# EAGLE design transponder (EAGLE 9.2.2)
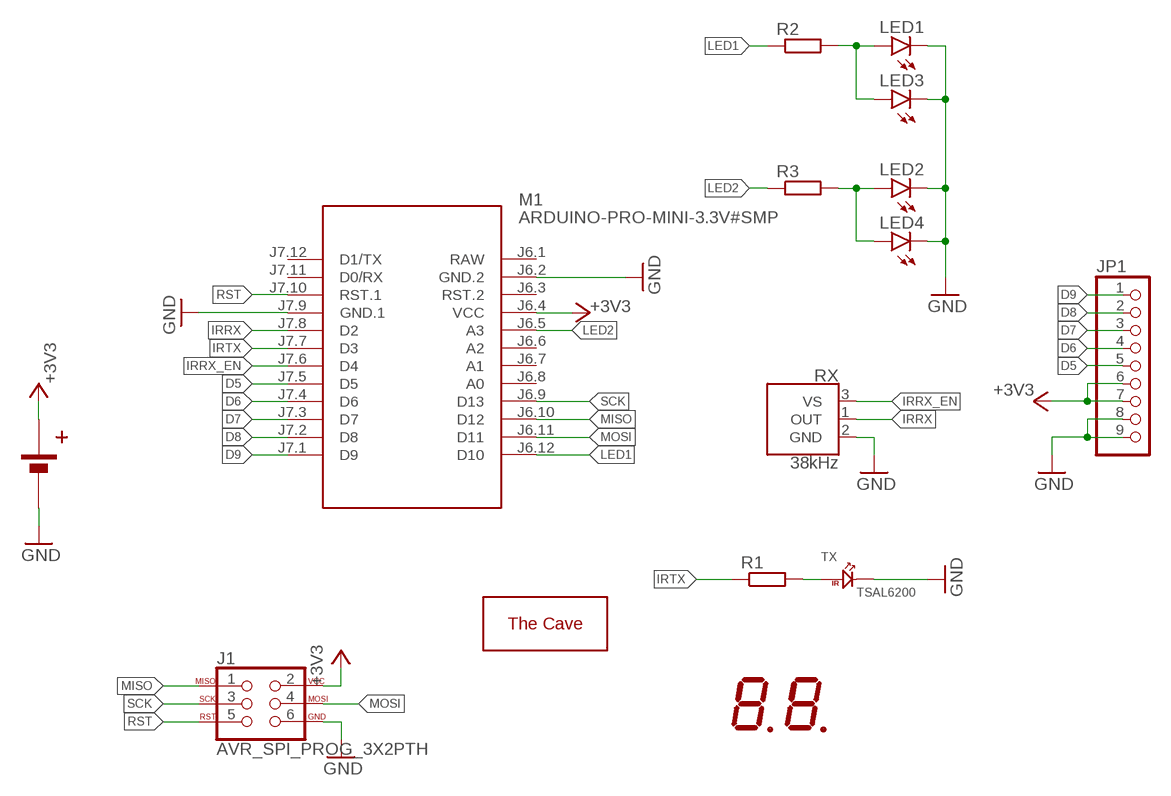
[diagram p0: schematic, sheet 1]

## Parts
BAT1  BH-321-2P  [2AA_BATTERY]
J1  AVR_SPI_PROG_3X2PTH  [2X3]
JP1  PINHD-1X9  [1X09]
LED1  LED5MM  [LED5MM]
LED2  LED5MM  [LED5MM]
LED3  LEDCHIPLED_1206  [CHIPLED_1206]
LED4  LEDCHIPLED_1206  [CHIPLED_1206]
LED5  LCD_DIGIT  [LCD_DIGIT]
LED6  LCD_DIGIT  [LCD_DIGIT]
M1  ARDUINO-PRO-MINI-3.3V#SMP  [ARDUINO-PRO-MINI#SMP]
R1  R-EU_R0805  [R0805]
R2  R-EU_R0805  [R0805]
R3  R-EU_R0805  [R0805]
RX  38kHz  TSOP38238  [TSOP382]
TX  TSAL6200  [TSAL6200]
U$1  THECAVE_LOGO_NEW_TOP_SMALL  [NEW_LOGO_SMALL_TOP]

## Nets
+3V3: BAT1.P$1(VCC) J1.2 JP1.6 JP1.7 M1.J6.4(VCC)
D5: JP1.5 M1.J7.5(D5)
D6: JP1.4 M1.J7.4(D6)
D7: JP1.3 M1.J7.3(D7)
D8: JP1.2 M1.J7.2(D8)
D9: JP1.1 M1.J7.1(D9)
GND: BAT1.P$2(GND) J1.6 JP1.8 JP1.9 LED1.K(C) LED2.K(C) LED3.C LED4.C M1.J6.2(GND.2) M1.J7.9(GND.1) RX.2(GND) TX.N
IRRX: M1.J7.8(D2) RX.1(OUT)
IRRX_EN: M1.J7.6(D4) RX.3(VS)
IRTX: M1.J7.7(D3) R1.1
LED1: M1.J6.12(D10) R2.1
LED2: M1.J6.5(A3) R3.1
MISO: J1.1 M1.J6.10(D12)
MOSI: J1.4 M1.J6.11(D11)
N$2: R1.2 TX.P
N$3: LED1.A LED3.A R2.2
N$5: LED2.A LED4.A R3.2
RST: J1.5 M1.J7.10(RST.1)
SCK: J1.3 M1.J6.9(D13)
Unconnected: M1.J6.3(RST.2) M1.J6.6(A2) M1.J6.7(A1) M1.J6.8(A0) M1.J7.11(D0/RX) M1.J7.12(D1/TX)

## Power pins joined to a net without a drawn wire
RAW: M1.J6.1(RAW)

## Library data of the parts
BAT1 = thecave:BH-321-2P: COMF BH-321-2P 2x AA battery holder https://www.tme.eu/cz/details/bh-321-2p/baterie-pouzdra-i-drzaky/comf/
J1 = SparkFun-Connectors:AVR_SPI_PROG_3X2: AVR ISP 6 Pin This is the reduced ISP connector for AVR programming. Common on Arduino. This footprint will take up less PCB space and can be used with a 10-pin to 6-pin adapter such as SKU: BOB-08508 **Special note about "TEST_POINT" package. The stop mask is on the top side, so if you want your programming test points to be on the bottom of your board, make sure to place this package on the bottom side of the board. This also ensure that the orientation to program from the bottom side will be correct. SparkFun Products: SparkFun ISP Pogo Adapter <https://www.sparkfun.com/products/11591> - NS Tiny AVR Programmer <https://www.sparkfun.com/products/11801> -PTH
JP1 = pinhead:PINHD-1X9: PIN HEADER
LED1-LED4 = led:LED: LED OSRAM: - CHIPLED LG R971, LG N971, LY N971, LG Q971, LY Q971, LO R971, LY R971 LH N974, LH R974 LS Q976, LO Q976, LY Q976 LO Q996 - Hyper CHIPLED LW Q18S LB Q993, LB Q99A, LB R99A - SideLED LS A670, LO A670, LY A670, LG A670, LP A670 LB A673, LV A673, LT A673, LW A673 LH A674 LY A675 LS A676, LA A676, LO A676, LY A676, LW A676 LS A679, LY A679, LG A679 - Hyper Micro SIDELED® LS Y876, LA Y876, LO Y876, LY Y876 LT Y87S - SmartLED LW L88C, LW L88S LB L89C, LB L89S, LG L890 LS L89K, LO L89K, LY L89K LS L896, LA L896, LO L896, LY L896 - TOPLED LS T670, LO T670, LY T670, LG T670, LP T670 LSG T670, LSP T670, LSY T670, LOP T670, LYG T670 LG T671, LOG T671, LSG T671 LB T673, LV T673, LT T673, LW T673 LH T674 LS T676, LA T676, LO T676, LY T676, LB T676, LH T676, LSB T676, LW T676 LB T67C, LV T67C, LT T67C, LS T67K, LO T67K, LY T67K, LW E67C LS E67B, LA E67B, LO E67B, LY E67B, LB E67C, LV E67C, LT E67C LW T67C LS T679, LY T679, LG T679 LS T770, LO T770, LY T770, LG T770, LP T770 LB T773, LV T773, LT T773, LW T773 LH T774 LS E675, LA E675, LY E675, LS T675 LS T776, LA T776, LO T776, LY T776, LB T776 LHGB T686 LT T68C, LB T68C - Hyper Mini TOPLED® LB M676 - Mini TOPLED Santana® LG M470 LS M47K, LO M47K, LY M47K Source: http://www.osram.convergy.de LUXEON: - LUMILED® LXK2-PW12-R00, LXK2-PW12-S00, LXK2-PW14-U00, LXK2-PW14-V00 LXK2-PM12-R00, LXK2-PM12-S00, LXK2-PM14-U00 LXK2-PE12-Q00, LXK2-PE12-R00, LXK2-PE12-S00, LXK2-PE14-T00, LXK2-PE14-U00 LXK2-PB12-K00, LXK2-PB12-L00, LXK2-PB12-M00, LXK2-PB14-N00, LXK2-PB14-P00, LXK2-PB14-Q00 LXK2-PR12-L00, LXK2-PR12-M00, LXK2-PR14-Q00, LXK2-PR14-R00 LXK2-PD12-Q00, LXK2-PD12-R00, LXK2-PD12-S00 LXK2-PH12-R00, LXK2-PH12-S00 LXK2-PL12-P00, LXK2-PL12-Q00, LXK2-PL12-R00 Source: www.luxeon.com KINGBRIGHT: KA-3528ASYC Source: www.kingbright.com
LED5 LED6 = thecave:LCD_DIGIT: Top silk LCD digit
M1 = diy-modules:ARDUINO-PRO-MINI-*#SMP: Arduino Pro Mini (and compatible devices) with 2 connectors only More details available here: https://www.arduino.cc/en/Main/ArduinoBoardProMini Click here to find device on ebay.com <http://www.ebay.com/sch/arduino+pro+mini>
R1-R3 = rcl:R-EU_: RESISTOR, European symbol; SPICEPREFIX: R
RX = SparkFun-Sensors:TSOP382: Vishay Semiconductor TSOP32838 - 38kHz IR Receiver These products are miniaturized IR receiver modules for infrared remote control systems. A PIN diode and a preamplifier are assembled on a leadframe, the epoxy package contains an IR filter. The demodulated output signal can be directly connected to a microprocessor for decoding.; PROD_ID: SEN-10266
TX = Seeed-OPL-2017-01-Sensor-camilo:TSAL6200: 314020023
U$1 = thecave:THECAVE_LOGO: The Cave DIY workshop logos thecave.cz

## Board
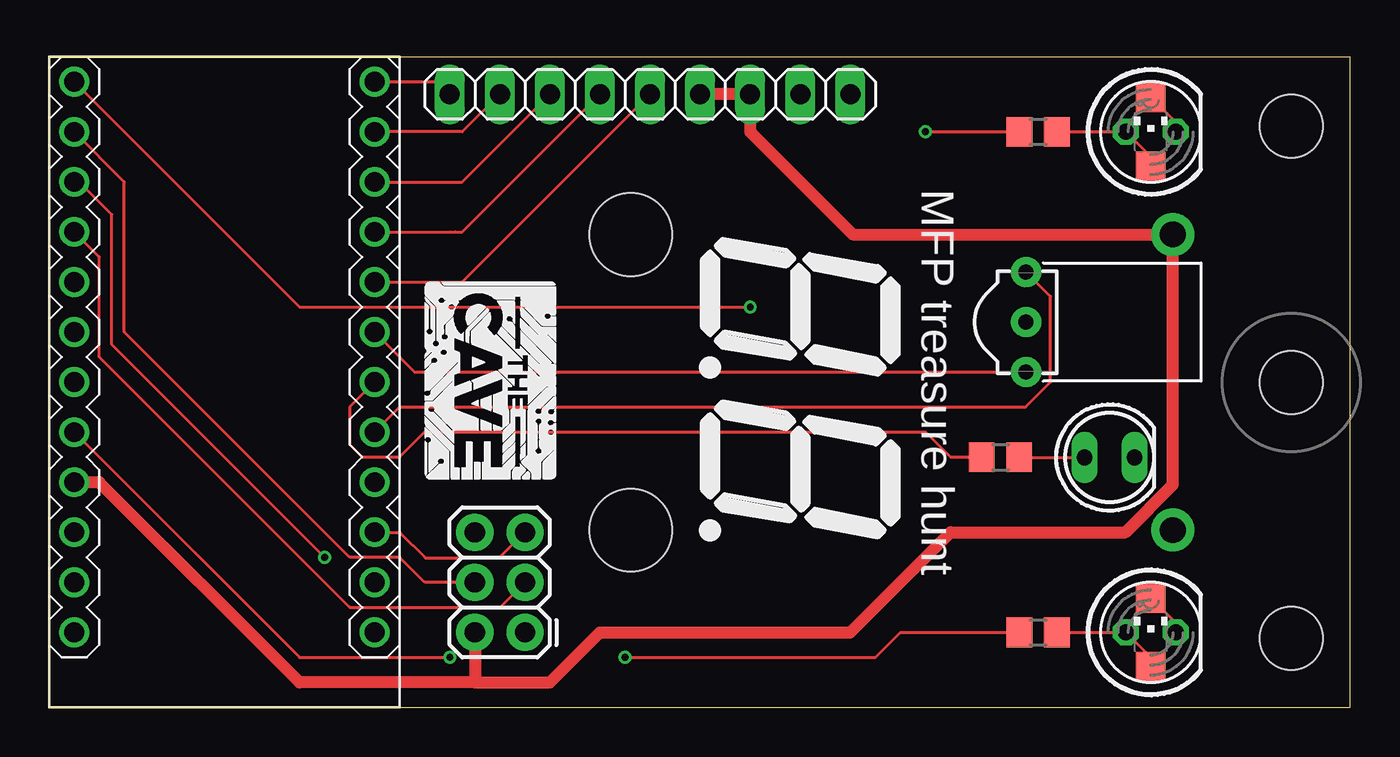
[diagram p1: board, top side]
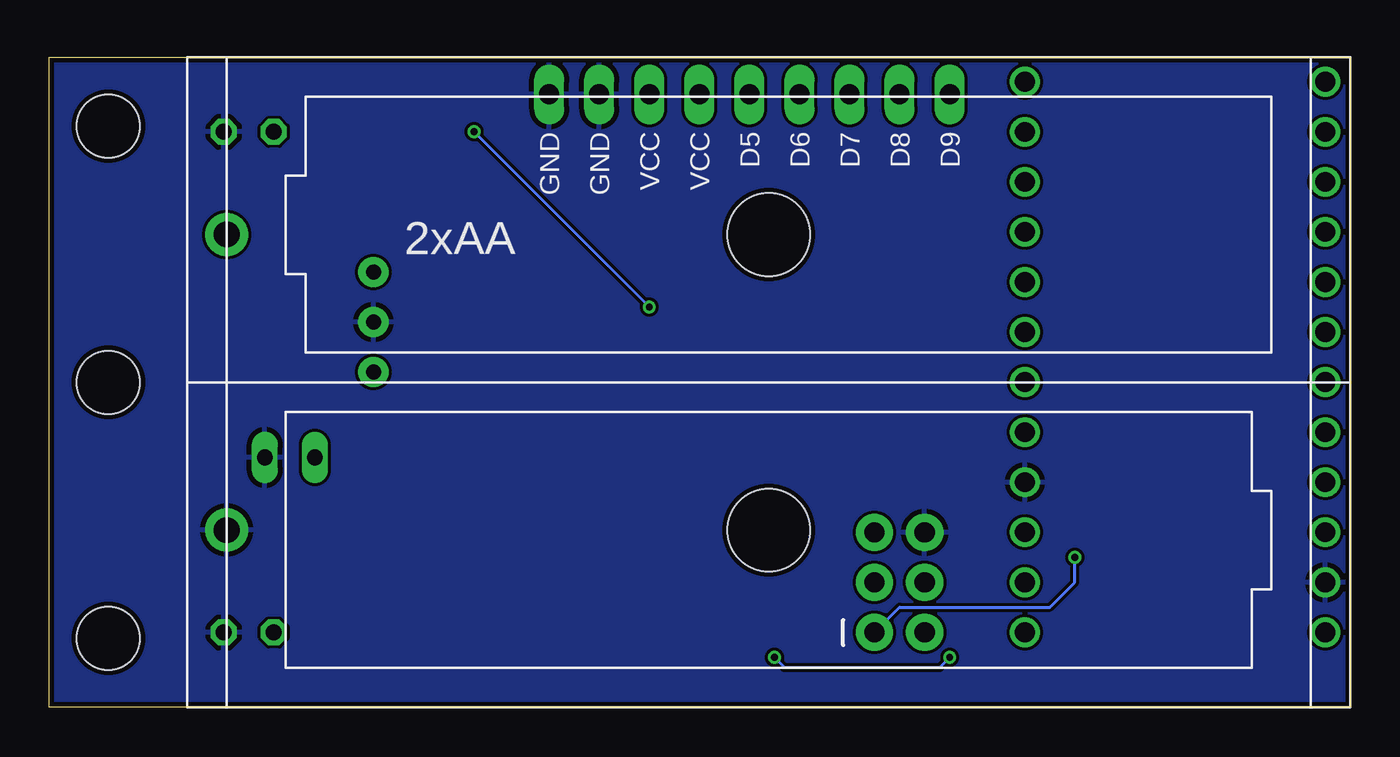
[diagram p2: board, bottom side, seen from below]

Size 66 x 33 mm. Coordinates in mm from the lower left corner, seen from the top.
Outline: 0,0 66,0 66,33 0,33 0,0
Copper layers (1*16): Top 0.035mm / dielectric 1.5mm / Bottom 0.035mm
Design rules "SeeedStudio_2layer_DRU_no_angle_20140221": minimum track width 6mil, minimum drill 12mil, track to track 6mil, track to pad 6mil, pad to pad 6mil, via to via 6mil, smd to smd 0mil, copper to edge 10mil, drill to drill 10mil, minimum pad ring 10mil, minimum via ring 6mil, stop-mask expansion 2mil, vias tented up to drill 100mil, thermal gap 10mil
Holes 3.2 mm at 63,16.5 63,29.5 63,3.5
tRestrict: area 26,20.5 to 33,27.5; area 25.7,5.2 to 33.3,12.8

### Footprints (pad centres in the part's own frame; a part is rotated, then mirrored left to right if it is on the bottom)
2AA_BATTERY = drill 1.3 pad 2.184: P$1 2,24; P$2 2,9 | hole 4.2: 29.5,24; 29.5,9
2X3 = drill 1.016 pad 1.88: 1 0,0; 2 0,2.54; 3 2.54,0; 4 2.54,2.54; 5 5.08,0; 6 5.08,2.54
1X09 = drill 1.016 long: 1 -10.16,0; 2 -7.62,0; 3 -5.08,0; 4 -2.54,0; 5 0,0; 6 2.54,0; 7 5.08,0; 8 7.62,0; 9 10.16,0
LED5MM = drill 0.813 octagon: A -1.27,0; K 1.27,0
CHIPLED_1206 = smd 1.5 x 1.5: A 0,-1.75; C 0,1.75
ARDUINO-PRO-MINI#SMP = drill 1: J6.1 -12.7,7.62; J6.2 -10.16,7.62; J6.3 -7.62,7.62; J6.4 -5.08,7.62; J6.5 -2.54,7.62; J6.6 0,7.62; J6.7 2.54,7.62; J6.8 5.08,7.62; J6.9 7.62,7.62; J6.10 10.16,7.62; J6.11 12.7,7.62; J6.12 15.24,7.62; J7.1 15.24,-7.62; J7.2 12.7,-7.62; J7.3 10.16,-7.62; J7.4 7.62,-7.62; J7.5 5.08,-7.62; J7.6 2.54,-7.62; J7.7 0,-7.62; J7.8 -2.54,-7.62; J7.9 -5.08,-7.62; J7.10 -7.62,-7.62; J7.11 -10.16,-7.62; J7.12 -12.7,-7.62
R0805 = smd 1.3 x 1.5: 1 -0.95,0; 2 0.95,0
TSOP382 = drill 0.762 pad 1.524: 1 -2.54,0; 2 0,0; 3 2.54,0
TSAL6200 = drill 0.8 long: N 1.27,0; P -1.27,0

### Placement (x,y rotation side)
BAT1  59,0 0 bottom
J1  24.13,3.81 90 top
JP1  30.48,31.11 0 top
LED1  55.88,29.21 0 top
LED2  55.88,3.81 0 top
LED3  55.88,29.21 0 top
LED4  55.88,3.81 0 top
LED5  38.1,12.06 270 top
LED6  38.1,20.32 270 top
M1  8.89,16.51 90 top
R1  48.26,12.7 0 top
R2  50.16,29.21 0 top
R3  50.16,3.81 0 top
RX  49.56,19.55 270 top
TX  53.8,12.68 0 top
U$1  19.05,21.59 270 top

### Tracks (layer width: path | path; a pad name or v marks a point on that pad's centre or on a via)
+3V3
  Top 0.61: J1.2 21.59,1.27 | 21.59,1.27 12.7,1.27 2.54,11.43 M1.J6.4 | JP1.6 JP1.7 35.56,29.21 40.77,24 BAT1.P$1 57,11.28 54.61,8.89 45.72,8.89 40.64,3.81 27.94,3.81 25.4,1.27 21.59,1.27
D5
  Top 0.152: JP1.5 20.95,21.59 M1.J7.5
D6
  Top 0.152: M1.J7.4 20.32,24.13 20.59,24.13 20.95,24.13 JP1.4
D7
  Top 0.152: JP1.3 20.95,26.67 M1.J7.3
D8
  Top 0.152: JP1.2 20.95,29.21 M1.J7.2
D9
  Top 0.152: M1.J7.1 19.73,31.75 19.71,31.72 JP1.1
GND
  Top 0.152: LED3.C 57.15,29.69 LED1.K | LED4.C 57.15,4.29 LED2.K
  pour Bottom: 0,33.02 0,0 66.04,0 66.04,33.02
IRRX
  Top 0.152: M1.J7.8 17.78,15.24 49.53,15.24 50.8,16.51 50.8,20.85 RX.1
IRRX_EN
  Top 0.152: M1.J7.6 18.55,17.02 RX.3
IRTX
  Top 0.152: M1.J7.7 15.24,15.24 15.24,13.34 15.88,12.7 17.78,12.7 19.05,13.97 44.45,13.97 45.72,12.7 R1.1
LED1  (via drill 0.35)
  Top 0.152: M1.J6.12 12.7,20.32 v35.56,20.32 | v44.45,29.21 R2.1
  Bottom 0.152: v35.56,20.32 v44.45,29.21
LED2  (via drill 0.35)
  Top 0.152: M1.J6.5 12.7,2.54 v20.32,2.54 | v29.21,2.54 41.91,2.54 43.18,3.81 R3.1
  Bottom 0.152: v20.32,2.54 20.83,2.03 28.7,2.03 v29.21,2.54
MISO  (via drill 0.35)
  Top 0.152: v13.97,7.62 3.17,18.41 3.17,25.02 1.53,26.67 M1.J6.10
  Bottom 0.152: J1.1 22.86,5.08 15.24,5.08 13.97,6.35 v13.97,7.62
MOSI
  Top 0.152: J1.4 19.05,6.35 17.78,7.62 15.24,7.62 3.81,19.05 3.81,26.67 M1.J6.11
N$2
  Top 0.152: R1.2 49.23,12.68 TX.P
N$3
  Top 0.152: R2.2 LED1.A 55.88,27.94 LED3.A
N$5
  Top 0.152: R3.2 LED2.A 55.88,2.54 LED4.A
RST
  Top 0.152: M1.J7.10 17.78,8.89 19.09,7.58 22.82,7.58 J1.5
SCK
  Top 0.152: M1.J6.9 2.54,22.86 2.54,17.78 15.24,5.08 22.86,5.08 J1.3

### Text on the board
tNames: MFP treasure hunt
bNames: D9 | D8 | D7 | D6 | D5 | VCC | VCC | GND | GND